# EAGLE design board2 (EAGLE 7.7.0)
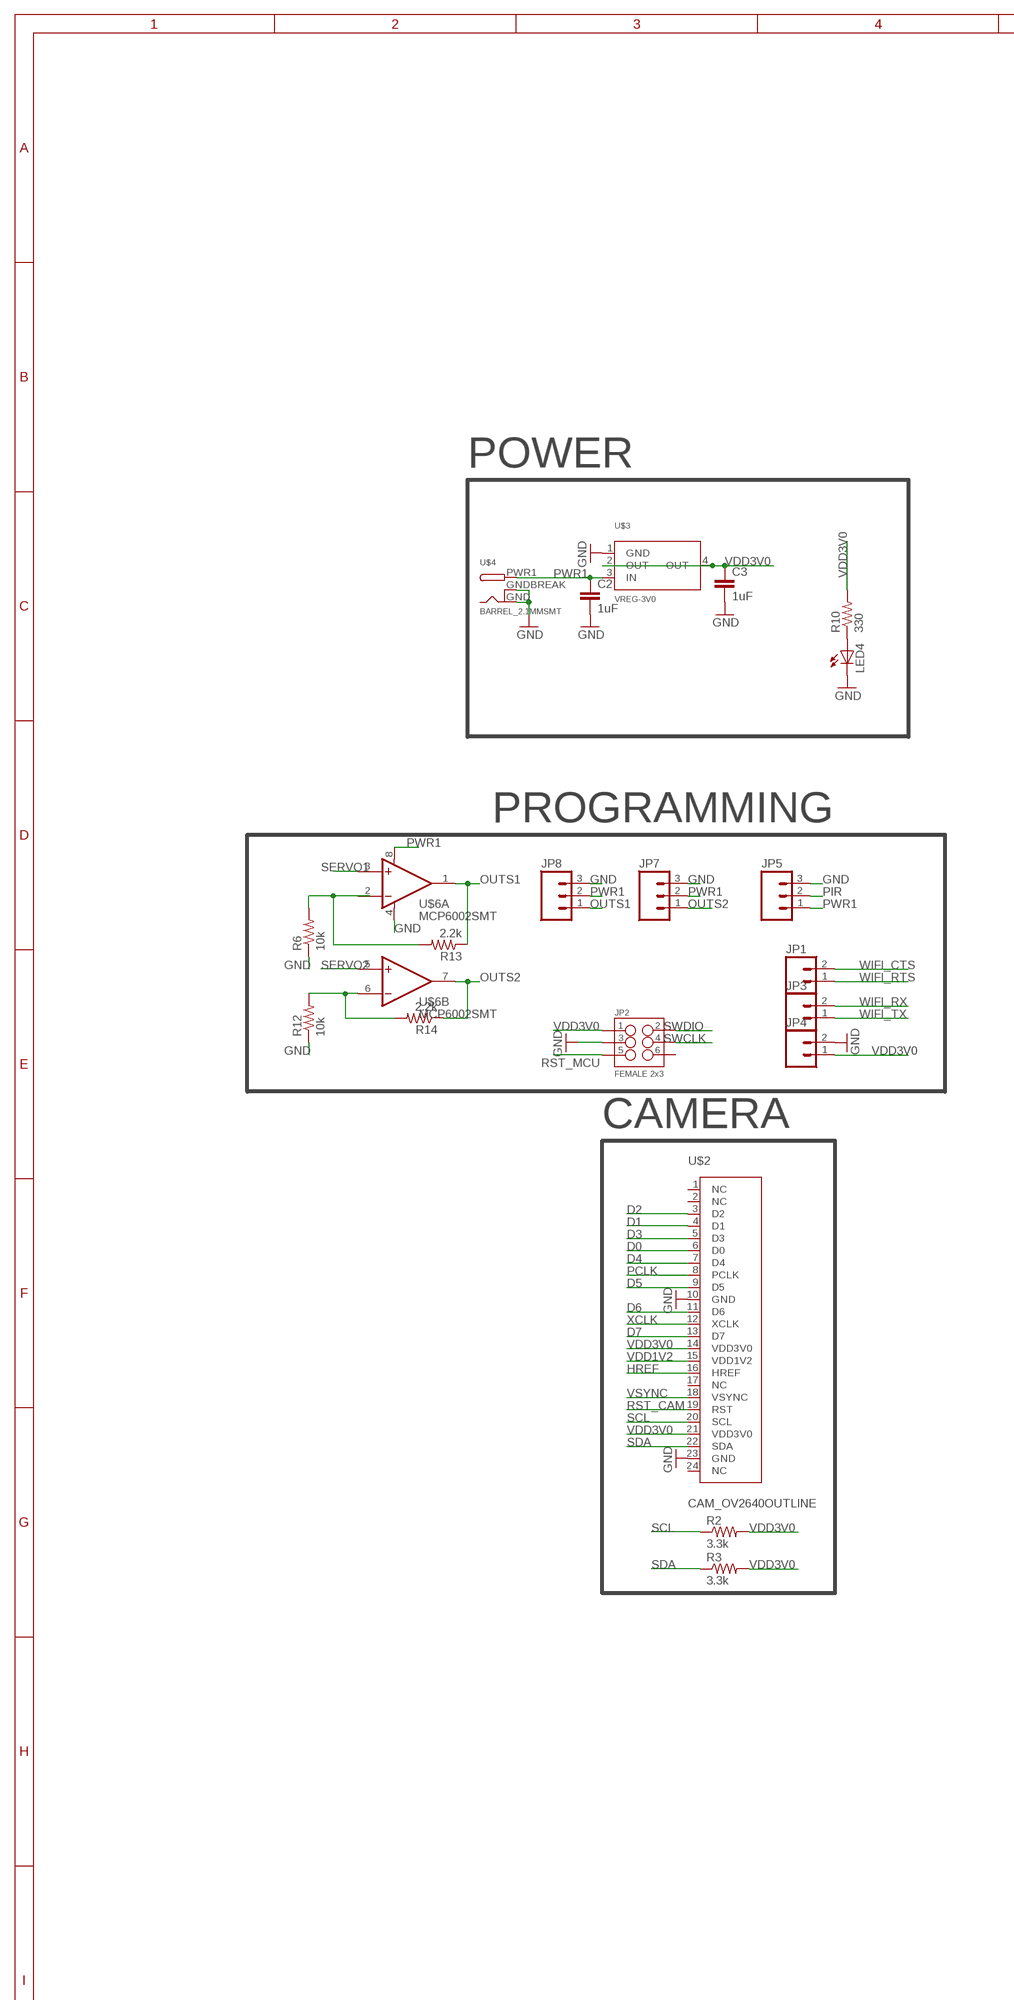
[diagram p0: schematic, sheet 1, part 1 of 2]
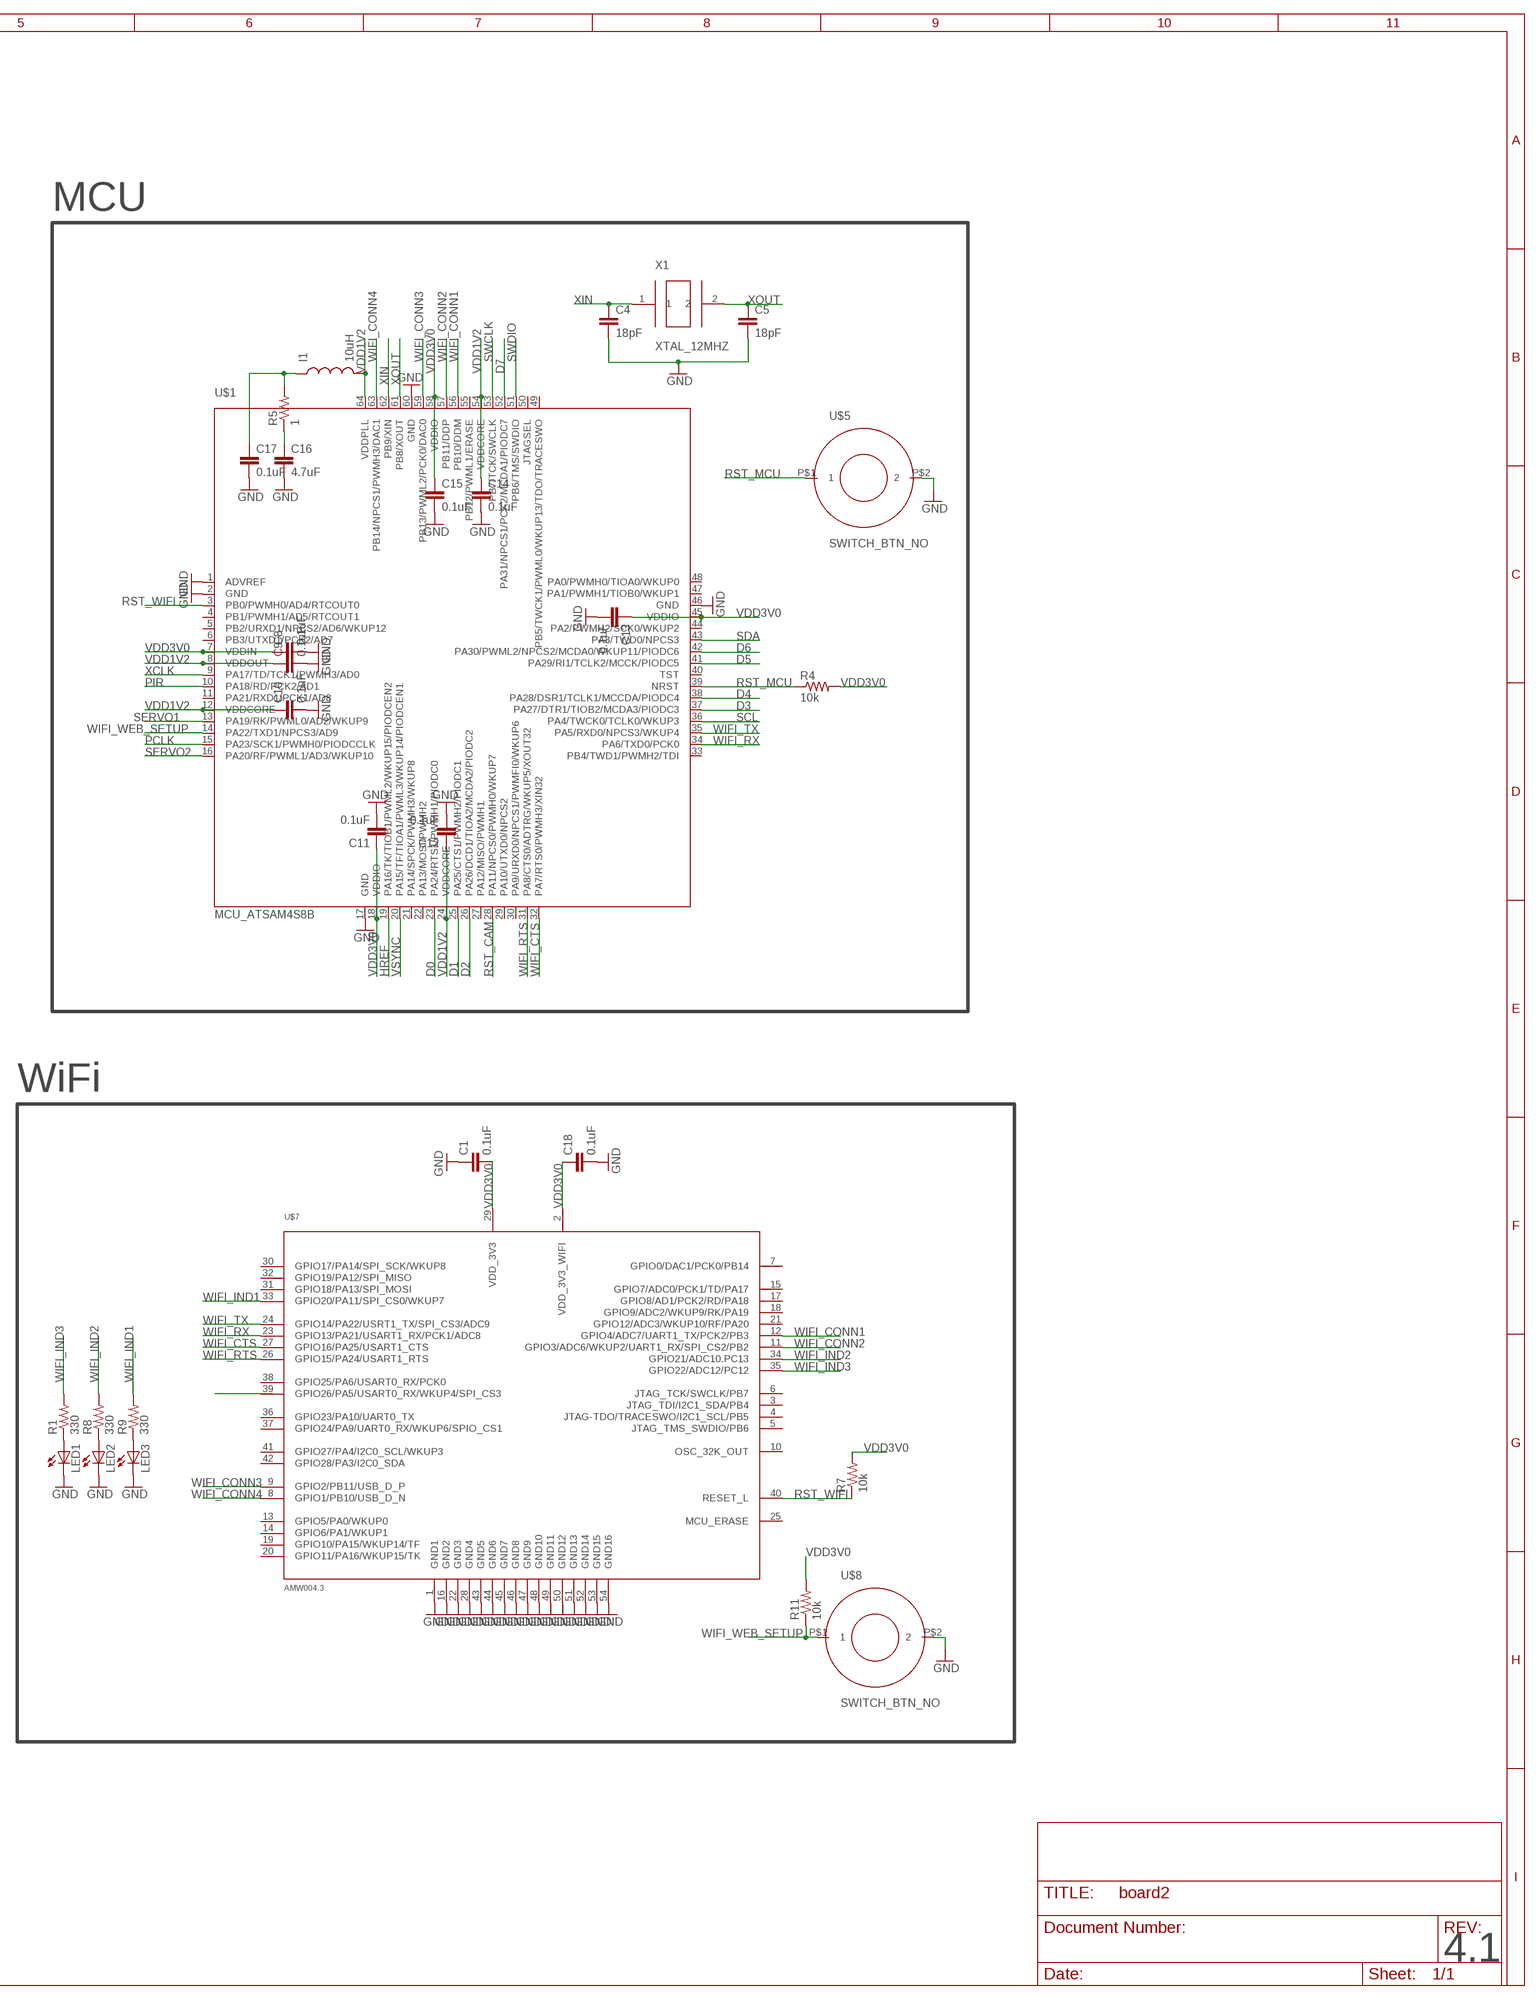
[diagram p1: schematic, sheet 1, part 2 of 2]

## Parts
C1  0.1uF  CAP  [0805]
C2  1uF  CAP  [0805]
C3  1uF  CAP  [0805]
C4  18pF  CAP  [0805]
C5  18pF  CAP  [0805]
C8  0.1uF  CAP  [0805]
C9  0.1uF  CAP  [0805]
C10  0.1uF  CAP  [0805]
C11  0.1uF  CAP  [0805]
C12  0.1uF  CAP  [0805]
C13  0.1uF  CAP  [0805]
C14  0.1uF  CAP  [0805]
C15  0.1uF  CAP  [0805]
C16  4.7uF  CAP  [0805]
C17  0.1uF  CAP  [0805]
C18  0.1uF  CAP  [0805]
I1  10uH  IND  [0805]
JP1  M02PTH  [1X02]
JP2  FEMALE 2x3  M03X2FEMALE  [2X3]
JP3  M02PTH  [1X02]
JP4  M02PTH  [1X02]
JP5  M03LOCK  [1X03_LOCK]
JP7  M03LOCK  [1X03_LOCK]
JP8  M03LOCK  [1X03_LOCK]
LED1  LED0603  [LED-0603]
LED2  LED0603  [LED-0603]
LED3  LED0603  [LED-0603]
LED4  LED0603  [LED-0603]
R1  330  RES  [0805]
R2  3.3k  RES  [0805]
R3  3.3k  RES  [0805]
R4  10k  RES  [0805]
R5  1  RES  [0805]
R6  10k  RES  [0805]
R7  10k  RES  [0805]
R8  330  RES  [0805]
R9  330  RES  [0805]
R10  330  RES  [0805]
R11  10k  RES  [0805]
R12  10k  RES  [0805]
R13  2.2k  RES  [0805]
R14  2.2k  RES  [0805]
U$1  MCU_ATSAM4S8B  [QFP50P1200X1200X160-64N]
U$2  CAM_OV2640OUTLINE  [CAM_CONN]
U$3  VREG-3V0  [R-PDSO-G4_TI]
U$4  BARREL_2.1MMSMT  [DCJACK_2MM_SMT]
U$5  SWITCH_BTN_NO  [BTN_2]
U$6  MCP6002SMT  [SOIC8]
U$7  AMW004.3  [AMW004]
U$8  SWITCH_BTN_NO  [BTN_2]
X1  XTAL_12MHZ  [ABM7-16.000MHZ-D2Y-T]

## Nets
D0: U$1.23(PA24/RTS1/PWMH1/PIODC0) U$2.6(D0)
D1: U$1.25(PA25/CTS1/PWMH2/PIODC1) U$2.4(D1)
D2: U$1.26(PA26/DCD1/TIOA2/MCDA2/PIODC2) U$2.3(D2)
D3: U$1.37(PA27/DTR1/TIOB2/MCDA3/PIODC3) U$2.5(D3)
D4: U$1.38(PA28/DSR1/TCLK1/MCCDA/PIODC4) U$2.7(D4)
D5: U$1.41(PA29/RI1/TCLK2/MCCK/PIODC5) U$2.9(D5)
D6: U$1.42(PA30/PWML2/NPCS2/MCDA0/WKUP11/PIODC6) U$2.11(D6)
D7: U$1.52(PA31/NPCS1/PCK2/MCDA1/PIODC7) U$2.13(D7)
GND: C1.1 C2.2 C3.2 C4.2 C5.2 C8.2 C9.2 C10.2 C11.2 C12.2 C13.2 C14.2 C15.2 C16.2 C17.2 C18.2 JP2.3 JP4.2 JP5.3 JP7.3 JP8.3 LED1.C LED2.C LED3.C LED4.C R6.1 R12.1 U$1.1(ADVREF) U$1.2(GND) U$1.17(GND) U$1.46(GND) U$1.60(GND) U$2.10(GND) U$2.23(GND) U$3.1(GND) U$4.GND U$4.GNDBREAK U$5.P$2 U$6.4(A:V-) U$7.1(GND1) U$7.16(GND2) U$7.22(GND3) U$7.28(GND4) U$7.43(GND5) U$7.44(GND6) U$7.45(GND7) U$7.46(GND8) U$7.47(GND9) U$7.48(GND10) U$7.49(GND11) U$7.50(GND12) U$7.51(GND13) U$7.52(GND14) U$7.53(GND15) U$7.54(GND16) U$8.P$2
HREF: U$1.19(PA16/TK/TIOB1/PWML2/WKUP15/PIODCEN2) U$2.16(HREF)
N$2: C17.1 I1.1 R5.2
N$3: C16.1 R5.1
N$4: LED1.A R1.1
N$5: LED2.A R8.1
N$6: LED3.A R9.1
N$7: LED4.A R10.1
N$8: R6.2 R13.2
N$14: R12.2 R14.2 U$6.6(B:-IN)
OUTS1: JP8.1 R13.1 U$6.1(A:OUT)
OUTS2: JP7.1 R14.1 U$6.7(B:OUT)
PCLK: U$1.15(PA23/SCK1/PWMH0/PIODCCLK) U$2.8(PCLK)
PIR: JP5.2 U$1.10(PA18/RD/PCK2/AD1)
PWR1: C2.1 JP5.1 JP7.2 JP8.2 U$3.3(IN) U$4.PWR1(PWR) U$6.8(A:V+)
RST_CAM: U$1.28(PA11/NPCS0/PWMH0/WKUP7) U$2.19(RST)
RST_MCU: JP2.5 R4.1 U$1.39(NRST) U$5.P$1
RST_WIFI: R7.1 U$1.3(PB0/PWMH0/AD4/RTCOUT0) U$7.40(RESET_L)
SCL: R2.1 U$1.36(PA4/TWCK0/TCLK0/WKUP3) U$2.20(SCL)
SDA: R3.1 U$1.43(PA3/TWD0/NPCS3) U$2.22(SDA)
SERVO1: U$1.13(PA19/RK/PWML0/AD2/WKUP9) U$6.3(A:+IN)
SERVO2: U$1.16(PA20/RF/PWML1/AD3/WKUP10) U$6.5(B:+IN)
SWCLK: JP2.4 U$1.53(PB7/TCK/SWCLK)
SWDIO: JP2.2 U$1.51(PB6/TMS/SWDIO)
VDD1V2: C9.1 C10.1 C12.1 C14.1 I1.2 U$1.8(VDDOUT) U$1.12(VDDCORE) U$1.24(VDDCORE) U$1.54(VDDCORE) U$1.64(VDDPLL) U$2.15(VDD1V2)
VDD3V0: C1.2 C3.1 C8.1 C11.1 C13.1 C15.1 C18.1 JP2.1 JP4.1 R2.2 R3.2 R4.2 R7.2 R10.2 R11.2 U$1.7(VDDIN) U$1.18(VDDIO) U$1.45(VDDIO) U$1.58(VDDIO) U$2.14(VDD3V0) U$2.21(VDD3V0) U$3.2(OUT) U$3.4(OUT) U$7.2(VDD_3V3_WIFI) U$7.29(VDD_3V3)
VSYNC: U$1.20(PA15/TF/TIOA1/PWML3/WKUP14/PIODCEN1) U$2.18(VSYNC)
WIFI_CONN1: U$1.56(PB10/DDM) U$7.12(GPIO4/ADC7/UART1_TX/PCK2/PB3)
WIFI_CONN2: U$1.57(PB11/DDP) U$7.11(GPIO3/ADC6/WKUP2/UART1_RX/SPI_CS2/PB2)
WIFI_CONN3: U$1.59(PB13/PWML2/PCK0/DAC0) U$7.9(GPIO2/PB11/USB_D_P)
WIFI_CONN4: U$1.63(PB14/NPCS1/PWMH3/DAC1) U$7.8(GPIO1/PB10/USB_D_N)
WIFI_CTS: JP1.2 U$1.32(PA7/RTS0/PWMH3/XIN32) U$7.27(GPIO16/PA25/USART1_CTS)
WIFI_IND1: R9.2 U$7.33(GPIO20/PA11/SPI_CS0/WKUP7)
WIFI_IND2: R8.2 U$7.34(GPIO21/ADC10.PC13)
WIFI_IND3: R1.2 U$7.35(GPIO22/ADC12/PC12)
WIFI_RTS: JP1.1 U$1.31(PA8/CTS0/ADTRG/WKUP5/XOUT32) U$7.26(GPIO15/PA24/USART1_RTS)
WIFI_RX: JP3.2 U$1.34(PA6/TXD0/PCK0) U$7.23(GPIO13/PA21/USART1_RX/PCK1/ADC8)
WIFI_TX: JP3.1 U$1.35(PA5/RXD0/NPCS3/WKUP4) U$7.24(GPIO14/PA22/USRT1_TX/SPI_CS3/ADC9)
WIFI_WEB_SETUP: R11.1 U$1.14(PA22/TXD1/NPCS3/AD9) U$8.P$1
XCLK: U$1.9(PA17/TD/TCK1/PWMH3/AD0) U$2.12(XCLK)
XIN: C4.1 U$1.62(PB9/XIN) X1.1
XOUT: C5.1 U$1.61(PB8/XOUT) X1.2
Unconnected: JP2.6 U$1.4(PB1/PWMH1/AD5/RTCOUT1) U$1.5(PB2/URXD1/NPCS2/AD6/WKUP12) U$1.6(PB3/UTXD1/PCK2/AD7) U$1.11(PA21/RXD1/PCK1/AD8) U$1.21(PA14/SPCK/PWMH3/WKUP8) U$1.22(PA13/MOSI/PWMH2) U$1.27(PA12/MISO/PWMH1) U$1.29(PA10/UTXD0/NPCS2) U$1.30(PA9/URXD0/NPCS1/PWMFI0/WKUP6) U$1.33(PB4/TWD1/PWMH2/TDI) U$1.40(TST) U$1.44(PA2/PWMH2/SCK0/WKUP2) U$1.47(PA1/PWMH1/TIOB0/WKUP1) U$1.48(PA0/PWMH0/TIOA0/WKUP0) U$1.49(PB5/TWCK1/PWML0/WKUP13/TDO/TRACESWO) U$1.50(JTAGSEL) U$1.55(PB12/PWML1/ERASE) U$2.1(NC) U$2.2(NC) U$2.17(NC) U$2.24(NC) U$6.2(A:-IN) U$7.3(JTAG_TDI/I2C1_SDA/PB4) U$7.4(JTAG-TDO/TRACESWO/I2C1_SCL/PB5) U$7.5(JTAG_TMS_SWDIO/PB6) U$7.6(JTAG_TCK/SWCLK/PB7) U$7.7(GPIO0/DAC1/PCK0/PB14) U$7.10(OSC_32K_OUT) U$7.13(GPIO5/PA0/WKUP0) U$7.14(GPIO6/PA1/WKUP1) U$7.15(GPIO7/ADC0/PCK1/TD/PA17) U$7.17(GPIO8/AD1/PCK2/RD/PA18) U$7.18(GPIO9/ADC2/WKUP9/RK/PA19) U$7.19(GPIO10/PA15/WKUP14/TF) U$7.20(GPIO11/PA16/WKUP15/TK) U$7.21(GPIO12/ADC3/WKUP10/RF/PA20) U$7.25(MCU_ERASE) U$7.30(GPIO17/PA14/SPI_SCK/WKUP8) U$7.31(GPIO18/PA13/SPI_MOSI) U$7.32(GPIO19/PA12/SPI_MISO) U$7.36(GPIO23/PA10/UART0_TX) U$7.37(GPIO24/PA9/UART0_RX/WKUP6/SPIO_CS1) U$7.38(GPIO25/PA6/USART0_RX/PCK0) U$7.39(GPIO26/PA5/USART0_RX/WKUP4/SPI_CS3) U$7.41(GPIO27/PA4/I2C0_SCL/WKUP3) U$7.42(GPIO28/PA3/I2C0_SDA)

## Notes on the sheet
- MCU
- POWER
- PROGRAMMING
- CAMERA
- WiFi
- 4.1

## Library data of the parts
C1-C5 C8-C18 = Ilya_Teach:CAP
I1 = Ilya_Teach:IND
JP1 JP3 JP4 = SparkFun:M02: Header 2 Standard 2-pin 0.1" header. Use with straight break away headers (SKU : PRT-00116), right angle break away headers (PRT-00553), swiss pins (PRT-00743), machine pins (PRT-00117), and female headers (PRT-00115). Molex polarized connector foot print use with SKU : PRT-08233 with associated crimp pins and housings.
JP2 = SparkFun-Connectors:M03X2: 2x3 .1" header. Shrouded, with keying- CONN-10681 SMT- CONN-11415 Pogo pins- HW-11044; PROD_ID: CONN-11566
JP5 JP7 JP8 = SparkFun:M03: Header 3 Standard 3-pin 0.1" header. Use with straight break away headers (SKU : PRT-00116), right angle break away headers (PRT-00553), swiss pins (PRT-00743), machine pins (PRT-00117), and female headers (PRT-00115). Molex polarized connector foot print use with SKU : PRT-08232 with associated crimp pins and housings.
LED1-LED4 = SparkFun:LED: LEDs Standard schematic elements and footprints for 5mm, 3mm, 1206, and 0603 sized LEDs. 5mm - Spark Fun Electronics SKU : COM-00529 (and others)
R1-R14 = Ilya_Teach:RES
U$1 = Ilya_Teach:MCU_ATSAM4S8B
U$2 = Ilya_Teach:CAM_OV2640
U$3 = Ilya_Teach:VREG-3V0
U$4 = Ilya_Teach:BARREL_2.1MM
U$5 U$8 = Ilya_Teach:SWITCH_BTN_NO
U$6 = adam - ics:MCP6002: Dual General Op Amp 1.8V min supply 1MHz (6V/us)
U$7 = AMW004_Eagle_PCB_Library:AMW004.3
X1 = Ilya_Teach:XTAL_12MHZ

## Board
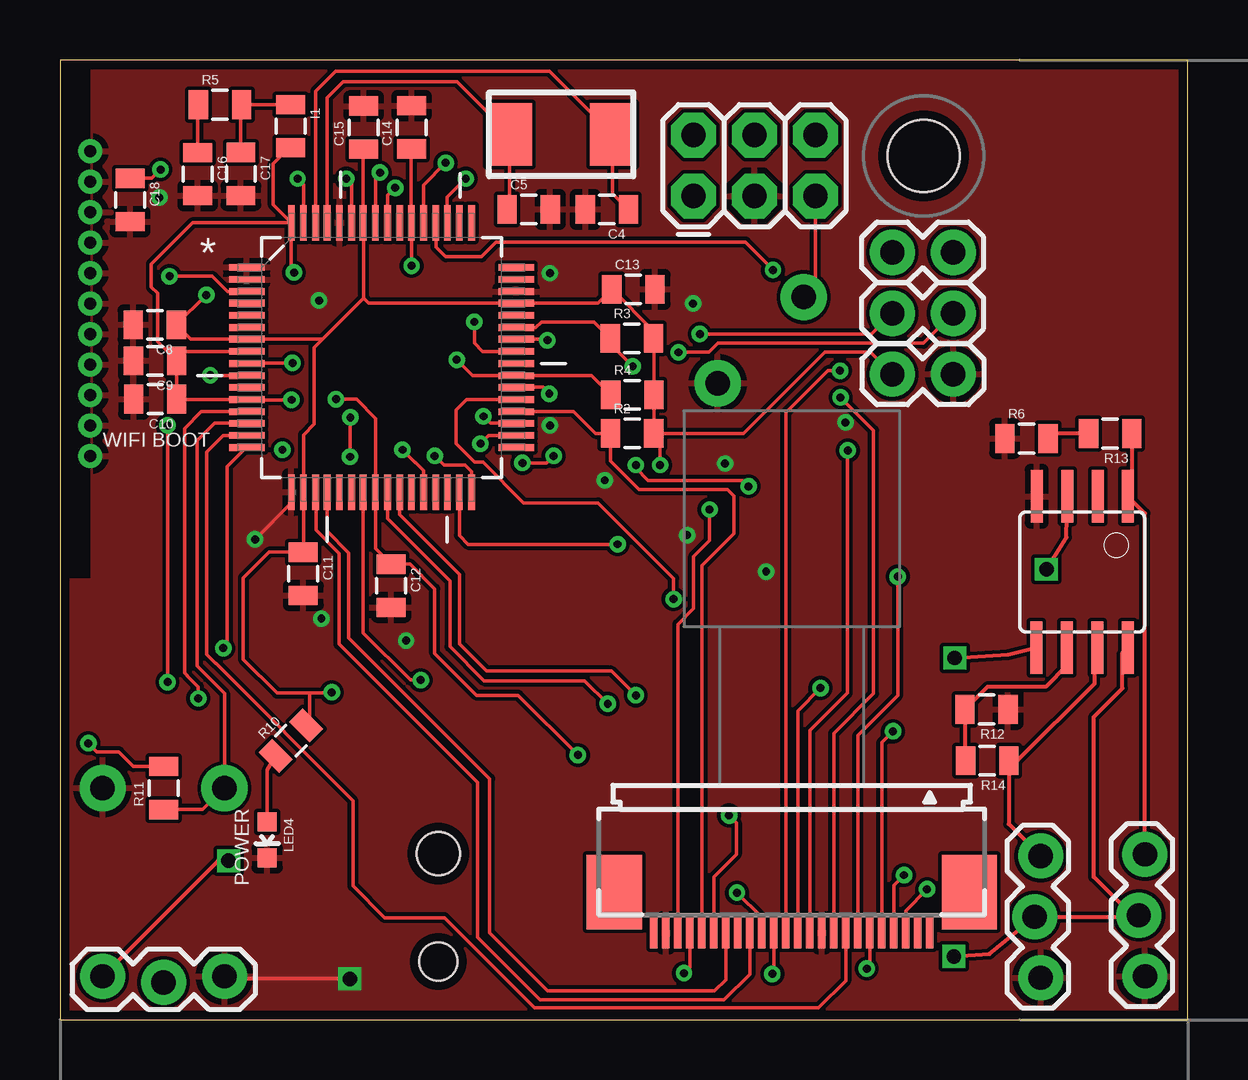
[diagram p2: board, top side]
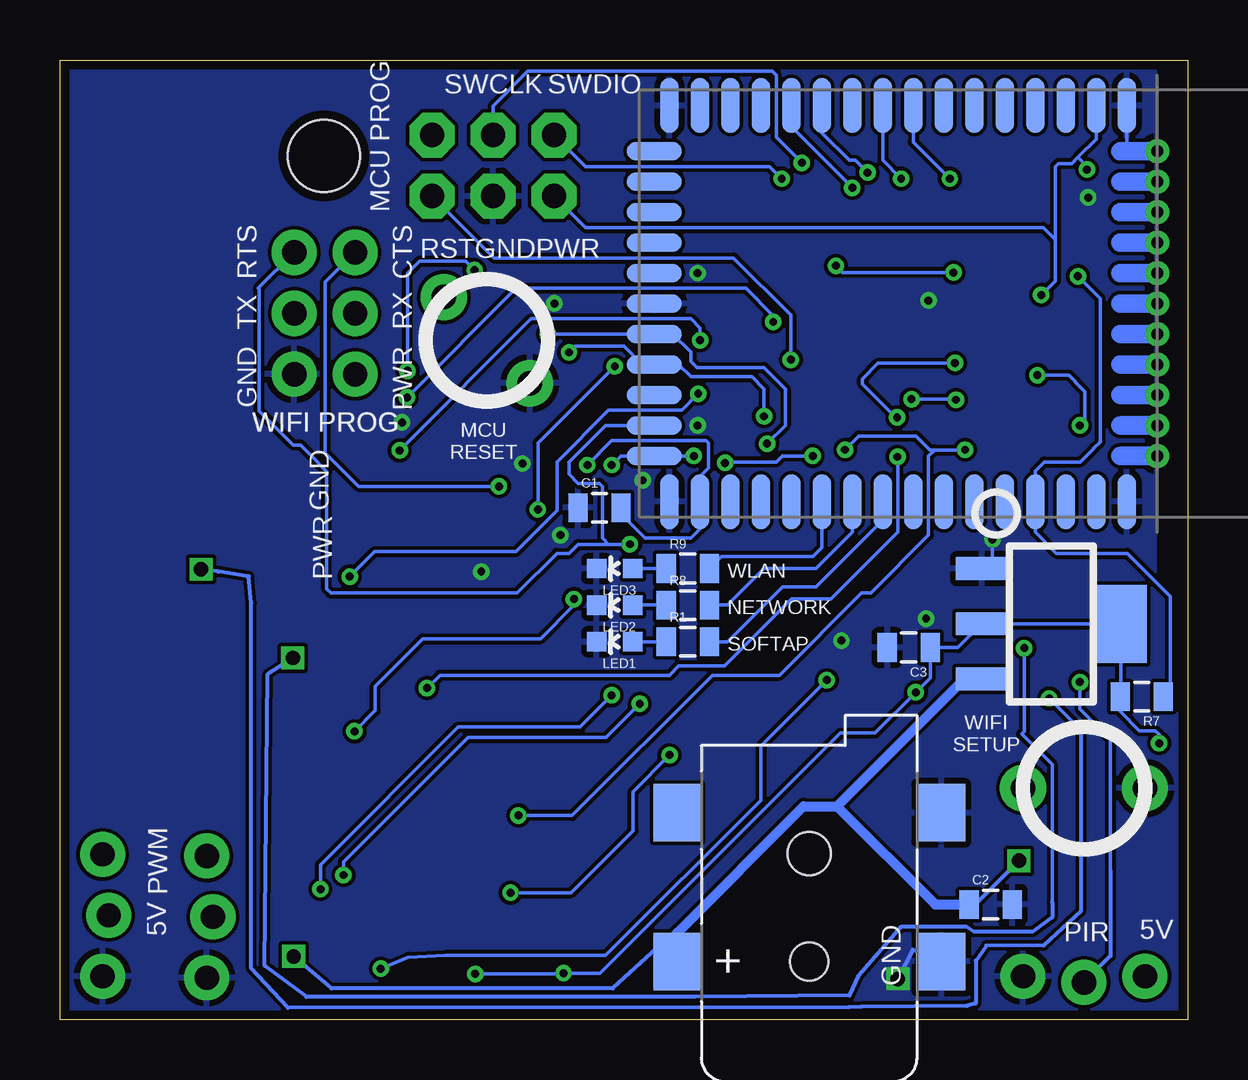
[diagram p3: board, bottom side, seen from below]

Size 47 x 40 mm. Coordinates in mm from the lower left corner, seen from the top.
Outline: 0,0 47,0 47,40 0,40 0,0
Copper layers (1*16): Top 0.0356mm / dielectric 1.5011mm / Bottom 0.0356mm
Design rules "LaenPCBOrder": minimum track width 6mil, minimum drill 13mil, track to track 6mil, track to pad 6mil, pad to pad 6mil, via to via 6mil, smd to smd 6mil, copper to edge 15mil, drill to drill 6mil, minimum pad ring 7mil, minimum via ring 7mil, stop-mask expansion 3mil, vias tented up to drill 0mil, thermal gap 10mil
Holes 3 mm at 36,36

### Footprints (pad centres in the part's own frame; a part is rotated, then mirrored left to right if it is on the bottom)
0805 = smd 0.8 x 1.2: 1 -0.9,0; 2 0.9,0
1X02 = drill 1.016 pad 1.88: 1 0,0; 2 2.54,0
2X3 = drill 1.016 pad 1.88 octagon: 1 0,0; 2 0,2.54; 3 2.54,0; 4 2.54,2.54; 5 5.08,0; 6 5.08,2.54
1X03_LOCK = drill 1.016 pad 1.88: 1 0,0.127; 2 2.54,-0.127; 3 5.08,0.127
LED-0603 = smd 0.8 x 0.8: A 0,-0.75; C 0,0.75
QFP50P1200X1200X160-64N = smd 1.473 x 0.279: 1 -5.613,3.759; 2 -5.613,3.251; 3 -5.613,2.743; 4 -5.613,2.261; 5 -5.613,1.753; 6 -5.613,1.245; 7 -5.613,0.762; 8 -5.613,0.254; 9 -5.613,-0.254; 10 -5.613,-0.762; 11 -5.613,-1.245; 12 -5.613,-1.753; 13 -5.613,-2.261; 14 -5.613,-2.743; 15 -5.613,-3.251; 16 -5.613,-3.759; 33 5.613,-3.759; 34 5.613,-3.251; 35 5.613,-2.743; 36 5.613,-2.261; 37 5.613,-1.753; 38 5.613,-1.245; 39 5.613,-0.762; 40 5.613,-0.254; 41 5.613,0.254; 42 5.613,0.762; 43 5.613,1.245; 44 5.613,1.753; 45 5.613,2.261; 46 5.613,2.743; 47 5.613,3.251; 48 5.613,3.759 | smd 0.279 x 1.473: 17 -3.759,-5.613; 18 -3.251,-5.613; 19 -2.743,-5.613; 20 -2.261,-5.613; 21 -1.753,-5.613; 22 -1.245,-5.613; 23 -0.762,-5.613; 24 -0.254,-5.613; 25 0.254,-5.613; 26 0.762,-5.613; 27 1.245,-5.613; 28 1.753,-5.613; 29 2.261,-5.613; 30 2.743,-5.613; 31 3.251,-5.613; 32 3.759,-5.613; 49 3.759,5.613; 50 3.251,5.613; 51 2.743,5.613; 52 2.261,5.613; 53 1.753,5.613; 54 1.245,5.613; 55 0.762,5.613; 56 0.254,5.613; 57 -0.254,5.613; 58 -0.762,5.613; 59 -1.245,5.613; 60 -1.753,5.613; 61 -2.261,5.613; 62 -2.743,5.613; 63 -3.251,5.613; 64 -3.759,5.613
CAM_CONN = smd 0.3 x 1.3: 1 -5.75,3.25; 2 -5.25,3.25; 3 -4.75,3.25; 4 -4.25,3.25; 5 -3.75,3.25; 6 -3.25,3.25; 7 -2.75,3.25; 8 -2.25,3.25; 9 -1.75,3.25; 10 -1.25,3.25; 11 -0.75,3.25; 12 -0.25,3.25; 13 0.25,3.25; 14 0.75,3.25; 15 1.25,3.25; 16 1.75,3.25; 17 2.25,3.25; 18 2.75,3.25; 19 3.25,3.25; 20 3.75,3.25; 21 4.25,3.25; 22 4.75,3.25; 23 5.25,3.25; 24 5.75,3.25 | smd 2.3 x 3.1: P1 -7.4,1.55; P2 7.4,1.55
R-PDSO-G4_TI = smd 0.95 x 2.15: 1 -2.3,-2.9; 2 0,-2.9; 3 2.3,-2.9 | smd 3.25 x 2.15: 4 0,2.9
DCJACK_2MM_SMT = smd 2.4 x 2: GND -2.54,-5.5; GNDBREAK 3.66,-5.5; PWR1 -2.54,5.5; PWR2 3.66,5.5 | hole 1.6: -2.54,0 | hole 1.8: 1.96,0
BTN_2 = drill 1.016 pad 1.93: P$1 -2.54,0; P$2 2.54,0
SOIC8 = smd 0.5 x 2.2: 1 -1.905,-3.154; 2 -0.645,-3.154; 3 0.625,-3.154; 4 1.895,-3.154; 5 1.905,3.154; 6 0.635,3.154; 7 -0.635,3.154; 8 -1.905,3.154
AMW004 = smd 0.762 x 2.286: 1 20.32,8.255; 2 19.05,8.255; 3 17.78,8.255; 4 16.51,8.255; 5 15.24,8.255; 6 13.97,8.255; 7 12.7,8.255; 8 11.43,8.255; 9 10.16,8.255; 10 8.89,8.255; 11 7.62,8.255; 12 6.35,8.255; 13 5.08,8.255; 14 3.81,8.255; 15 2.54,8.255; 16 1.27,8.255; 28 1.27,-8.255; 29 2.54,-8.255; 30 3.81,-8.255; 31 5.08,-8.255; 32 6.35,-8.255; 33 7.62,-8.255; 34 8.89,-8.255; 35 10.16,-8.255; 36 11.43,-8.255; 37 12.7,-8.255; 38 13.97,-8.255; 39 15.24,-8.255; 40 16.51,-8.255; 41 17.78,-8.255; 42 19.05,-8.255; 43 20.32,-8.255 | smd 2.286 x 0.762: 17 0.635,6.35; 18 0.635,5.08; 19 0.635,3.81; 20 0.635,2.54; 21 0.635,1.27; 22 0.635,0; 23 0.635,-1.27; 24 0.635,-2.54; 25 0.635,-3.81; 26 0.635,-5.08; 27 0.635,-6.35 | drill 0.5 pad 1: 44 21.59,-6.35; 45 21.59,-5.08; 46 21.59,-3.81; 47 21.59,-2.54; 48 21.59,-1.27; 49 21.59,0; 50 21.59,1.27; 51 21.59,2.54; 52 21.59,3.81; 53 21.59,5.08; 54 21.59,6.35
ABM7-16.000MHZ-D2Y-T = smd 1.9 x 2.6: 1 -2.15,0; 2 2.15,0

### Placement (x,y rotation side)
C1  24.51,21.34 0 bottom
C2  8.21,4.8 0 bottom
C3  11.62,15.51 180 bottom
C4  22.8,33.77 180 top
C5  19.54,33.77 0 top
C8  3.95,28.96 180 top
C9  3.96,27.46 180 top
C10  3.97,25.86 180 top
C11  10.14,18.58 270 top
C12  13.8,18.08 270 top
C13  23.9,30.44 0 top
C14  14.66,37.19 90 top
C15  12.66,37.18 90 top
C16  5.74,35.24 270 top
C17  7.54,35.25 270 top
C18  2.92,34.16 270 top
I1  9.61,37.24 270 top
JP1  37.24,31.98 180 top
JP2  26.41,34.33 0 top
JP3  37.24,29.44 180 top
JP4  34.7,26.9 0 top
JP5  1.78,1.68 0 top
JP7  40.75,6.82 270 top
JP8  45.1,6.88 270 top
LED1  23.88,15.75 90 bottom
LED2  23.88,17.27 90 bottom
LED3  23.88,18.8 90 bottom
LED4  8.64,7.49 180 top
R1  20.83,15.75 0 bottom
R2  23.85,24.43 0 top
R3  23.84,28.4 0 top
R4  23.86,26.04 0 top
R5  6.67,38.14 0 top
R6  40.28,24.22 0 top
R7  1.91,13.46 180 bottom
R8  20.83,17.27 0 bottom
R9  20.83,18.8 0 bottom
R10  9.63,11.62 45 top
R11  4.32,9.65 90 top
R12  38.62,12.93 180 top
R13  43.78,24.42 180 top
R14  38.65,10.79 180 top
U$1  13.4,27.6 0 top
U$2  30.5,6.87 180 top
U$3  5.68,16.5 270 bottom
U$4  15.77,4.96 90 bottom
U$5  29.21,28.32 315 bottom
U$6  42.61,18.66 180 top
U$7  22.86,29.84 0 bottom
U$8  4.32,9.65 0 bottom
X1  20.89,36.9 180 top

### Tracks (layer width: path | path; a pad name or v marks a point on that pad's centre or on a via)
D0  (via drill 0.33)
  Top 0.152: U$1.23 12.64,16.11 14.61,14.15 v15.04,14.15 | U$2.6 33.75,2.43 v33.63,2.12
  Bottom 0.152: v33.63,2.12 32.49,2.6 30.94,2.67 24.26,2.67 17.78,9.14 17.78,11.4 v15.04,14.15
D1  (via drill 0.33)
  Top 0.152: U$1.25 13.65,20.89 16.26,18.29 16.26,15.54 17.68,14.12 21.87,14.12 v22.84,13.16 | U$2.4 34.75,5.59 v35.18,6.02
  Bottom 0.152: v35.18,6.02 35.18,6.58 30,11.76 24.23,11.76 v22.84,13.16
D2  (via drill 0.33)
  Top 0.152: U$1.26 14.16,21.04 16.66,18.54 16.66,15.65 17.78,14.53 22.99,14.53 v24,13.51 | U$2.3 35.25,4.54 v36.14,5.44
  Bottom 0.152: v36.14,5.44 36.14,6.45 30.4,12.19 25.32,12.19 v24,13.51
D3  (via drill 0.33)
  Top 0.152: U$2.5 34.25,11.54 v34.72,12.01 | U$1.37 16.96,25.85 16.51,25.4 16.51,24 17.27,23.24 17.63,23.24 19.33,21.54 22.43,21.54 25.58,18.39 v25.58,17.53
  Bottom 0.152: v34.72,12.01 33.86,12.88 33.86,13.89 31.88,15.88 26.98,15.88 25.58,17.27 v25.58,17.53
D4  (via drill 0.33)
  Top 0.152: U$2.7 33.25,11.84 34.92,13.51 v34.92,18.47 | v20.4,26.09 20.13,26.36 U$1.38
  Bottom 0.152: v20.4,26.09 21.08,25.4 24.13,25.4 26.29,23.24 26.29,21.21 27.99,19.51 33.88,19.51 v34.92,18.47
D5  (via drill 0.33)
  Top 0.152: U$2.9 32.25,11.93 33.91,13.59 33.91,24.56 v32.54,25.93 | v17.27,29.08 17.27,28.19 17.61,27.85 U$1.41
  Bottom 0.152: v32.54,25.93 27.99,30.48 18.41,30.48 17.27,29.34 v17.27,29.08
D6  (via drill 0.33)
  Top 0.152: U$2.11 31.25,12.05 32.82,13.61 32.82,23.7 v32.84,23.72 | v20.32,28.32 20.28,28.36 U$1.42
  Bottom 0.152: v32.84,23.72 27.36,29.21 20.7,29.21 20.32,28.83 v20.32,28.32
D7  (via drill 0.33)
  Top 0.152: U$1.52 15.67,33.2 15.67,32.21 16.08,31.8 17.58,31.8 18.19,32.41 28.57,32.41 29.72,31.27 v29.72,31.24 | U$2.13 30.25,25.3 32,27.05 v32.51,27.05
  Bottom 0.152: v32.51,27.05 32.51,31.11 32,31.62 30.1,31.62 v29.72,31.24
GND  (via drill 0.33, 0.6)
  Top 0.152: U$1.17 9.64,21.53 v8.13,20.02
  Top 0.16: v12.08,1.69 6.97,1.69 JP5.3
  Bottom 0.152: U$7.1 2.54,36.2 U$7.54 | v8.13,20.02 8.13,19.25 U$3.1
  Bottom 0.16: U$4.GND 11.45,2.91 v12.08,1.69
  other vias: 14.43,15.8 10.9,16.71 20.42,31.11 10.79,29.97 4.14,34.26 26.39,29.84 29.44,18.67 22.71,22.48 20.42,24.77 26.14,20.19 32.74,24.89 27.72,23.18
  pour Top: 0,0 47.01,0.11 47.01,40.11 0,40
  pour Bottom: 0,0 47.1,0 47.1,39.89 0,40
HREF
  Top 0.152: U$2.16 28.75,1.88 27.69,0.81 20.02,0.81 17.4,3.43 17.4,9.88 11.63,15.65 11.63,19.43 10.67,20.4 10.67,21.98 U$1.19
N$2
  Top 0.152: I1.1 R5.2 7.54,38.11 C17.1
N$3
  Top 0.152: R5.1 5.74,38.11 C16.1
N$4
  Bottom 0.152: R1.1 LED1.A
N$5
  Bottom 0.152: R8.1 LED2.A
N$6
  Bottom 0.152: R9.1 LED3.A
N$7
  Top 0.152: LED4.A 8.64,10.41 R10.1
N$8
  Top 0.16: R13.2 41.39,24.42 R6.2
N$14
  Top 0.16: U$6.6 41.97,14.76 41.08,13.87 38.66,13.87 R12.2 37.72,10.82 R14.2
OUTS1
  Top 0.16: JP8.1 45.23,21.1 U$6.1 44.68,21.97 R13.1
OUTS2
  Top 0.16: JP7.1 39.55,8.15 R14.1 39.92,10.79 43.13,14.01 43.13,15.39 U$6.7
PCLK
  Top 0.152: U$1.15 6.8,24.35 6.11,23.66 6.11,15.21 6.49,14.83 6.5,14.83 12.22,9.12 12.22,5.56 13.54,4.24 16.03,4.24 19.79,0.48 31.62,0.48 32.75,1.61 U$2.8
PIR  (via drill 0.33)
  Top 0.152: U$1.10 6.28,26.84 v6.26,26.86 | v4.48,24.77 v4.48,14.07
  Bottom 0.152: v6.26,26.86 4.94,26.86 4.67,26.59 4.67,26.57 4.28,26.18 4.28,24.97 v4.48,24.77 | v4.48,14.07 4.48,12.95 3.21,11.68 3.21,6.18
  Bottom 0.16: 3.21,6.18 3.21,2.65 JP5.2
PWR1  (via drill 0.6)
  Top 0.16: v7.02,6.62 6.59,6.62 JP5.1 | v37.26,2.63 38.75,2.73 JP7.2 44.91,4.28 JP8.2 44.69,4.34 43.09,5.94 43.09,12.61 44.28,13.8 44.28,15.27 U$6.8
  Bottom 0.16: C2.1 8.84,4.8 v7.02,6.62 | 21.27,3.62 21.42,3.62 23.96,1.29 35.69,1.29 v37.26,2.63
  Bottom 0.406: 8.58,14.26 U$3.3 9.3,14.2 14.61,8.89 | U$4.PWR1 21.27,3.62 16,8.89 14.61,8.89 | 14.61,8.89 10.51,4.8 C2.1
RST_CAM  (via drill 0.33)
  Top 0.152: v27.89,8.51 28.19,8.2 28.19,6.88 27.25,5.94 U$2.19 | v9.27,23.75 9.18,23.84 | U$1.28 15.15,22.88 14.82,23.22 14.81,23.22 v14.28,23.75
  Bottom 0.152: v27.89,8.51 25.65,8.51 19.81,14.35 17.02,14.35 13.59,17.78 13.21,17.78 10.79,20.19 10.79,23.5 10.54,23.75 | 10.54,23.75 v9.27,23.75 | 10.54,23.75 10.74,23.75 11.33,24.33 13.7,24.33 14.28,23.76 v14.28,23.75
RST_MCU  (via drill 0.33)
  Top 0.152: R4.1 22.16,26.84 U$1.39 17.21,26.84 v16.54,27.51 16.46,27.51 | U$5.P$1 31.49,30.6 JP2.5
  Bottom 0.152: JP2.5 28.91,31.75 18.92,31.75 16.54,29.36 v16.54,27.51
RST_WIFI  (via drill 0.33)
  Top 0.152: v4.57,30.99 6.35,30.99 7,30.34 U$1.3
  Bottom 0.152: v4.57,30.99 3.65,30.06 3.65,24.08 3.9,23.82 3.9,23.81 4.47,23.24 5.97,23.24 6.35,22.86 U$7.40 6.35,20.32 5.46,19.43 2.52,19.43 0.72,17.64 0.72,13.74 R7.1
SCL
  Top 0.152: U$1.36 21.41,25.34 22.32,24.43 R2.1 22.95,23.28 24.13,22.1 27.81,22.1 28.09,21.82 28.09,20.27 26.75,18.93 U$2.20
SDA  (via drill 0.33)
  Top 0.152: v23.88,27.23 22.94,28.16 R3.1 22.26,29.08 20.07,29.08 19.83,28.84 U$1.43 | U$2.22 25.75,16.48 26.42,17.14 26.42,19.3 27.08,19.96 v27.08,21.26
  Bottom 0.152: v23.88,27.23 27.08,24.03 v27.08,21.26
SERVO1  (via drill 0.33, 0.6)
  Top 0.152: v5.77,13.39 5.77,13.87 5.31,14.33 5.31,14.34 5.19,14.45 5.19,24.64 5.89,25.34 U$1.13
  Top 0.16: v41.12,18.77 41.95,20.1 U$6.3
  Bottom 0.152: 4.46,12.08 v5.77,13.39
  Bottom 0.16: 4.46,12.08 4.46,4.51 5.99,3.09 8.39,3.07 8.83,2.45 8.83,0.67 9.2,0.57 13.58,0.53 14.1,0.52 37.49,0.48 39.03,2.13 39.03,17.36 39.13,18.48 40.39,18.67 v41.12,18.77
SERVO2  (via drill 0.33, 0.6)
  Top 0.152: U$1.16 7.76,23.84 6.97,23.05 6.97,15.65 v6.81,15.48
  Top 0.16: v37.3,15.07 39.53,15.21 U$6.5
  Bottom 0.152: v6.81,15.48 6.81,12 6.91,11.9 5.64,10.63 5.64,4.89
  Bottom 0.16: 5.64,4.89 5.64,4.25 6.45,3.66 8.9,3.66 9.22,3.87 11.94,3.86 13.73,1.82 14.08,1 20.51,0.95 36.73,0.94 38.47,2.23 38.34,14.4 v37.3,15.07
SWCLK  (via drill 0.33)
  Top 0.152: U$1.53 15.15,34.79 v16.08,35.71
  Bottom 0.152: JP2.4 28.95,38.08 27.51,39.52 17.3,39.52 17.14,39.37 17.14,36.78 v16.08,35.71
SWDIO  (via drill 0.33)
  Top 0.152: U$1.51 16.14,34.28 v16.92,35.05
  Bottom 0.152: v16.92,35.05 17.42,35.56 25.1,35.56 JP2.2
VDD1V2  (via drill 0.33)
  Top 0.152: C9.1 5.25,27.85 U$1.8 | C9.1 C10.1 4.88,25.85 U$1.12 7.8,25.83 v9.65,25.83 | C14.1 14.64,36.27 U$1.54 14.66,33.2 v14.66,31.42 | 9.64,36.31 I1.2 9.54,36.34 8.89,35.69 8.89,33.96 U$1.64 | U$1.64 5.53,33.21 3.81,31.5 3.81,30.53 4.06,30.28 4.06,28.26 C9.1 | U$2.15 29.25,4.25 v28.22,5.28 | v21.59,11.02 19.1,13.51 17.37,13.51 15.62,15.27 15.62,17.96 14.6,18.98 C12.1 13.15,19.64 U$1.24 13.15,24.22 13.16,24.23 13.16,25.06 12.36,25.86 v11.51,25.86 | U$1.64 9.64,31.25 v9.75,31.14
  Bottom 0.152: v11.51,25.86 9.68,25.86 v9.65,25.83 | v9.75,31.14 14.38,31.14 v14.66,31.42 | v28.22,5.28 25.7,5.28 23.11,7.87 23.11,9.5 v21.59,11.02
VDD3V0  (via drill 0.33)
  Top 0.152: C11.1 U$1.18 10.15,24.37 10.59,24.82 10.59,28.02 10.94,28.36 | C15.1 12.64,36.26 U$1.58 12.65,30.07 | R2.2 R4.2 24.76,28.38 R3.2 24.74,28.7 C13.1 22.42,29.86 U$1.45 12.86,29.86 12.65,30.07 | 10.94,28.36 U$1.7 5.45,28.36 C8.1 v6.09,30.2 v6.1,30.2 | 10.94,28.36 12.65,30.07 | C11.1 10.64,19.48 | C11.1 8.71,19.48 7.64,18.41 7.64,15.01 9.04,13.61 10.41,13.61 | 10.41,13.61 11.3,13.61 v11.33,13.64 | U$2.21 26.25,2.17 v26.01,1.93 | U$2.14 29.75,1.96 v29.69,1.91 | C18.1 3.82,35.06 v4.19,35.43 | JP4.1 33.78,27.81 31.88,27.81 28.5,24.43 R2.2 | R2.2 25.02,24.17 v25.02,23.11 | R10.2 10.41,12.45 10.41,13.61 | R11.2 3.06,10.55 2.45,11.16 1.54,11.16 v1.18,11.52
  Bottom 0.152: 10.69,15.48 C3.1 | C3.1 10.72,14.25 v11.33,13.64 13.03,11.94 14.48,11.94 24.49,1.93 v26.01,1.93 26.04,1.91 v29.69,1.91 | 5.51,32.51 5.51,35.56 5.38,35.69 4.83,35.69 4.57,35.94 | 5.51,32.51 5.51,30.79 v6.1,30.2 | JP2.1 25.1,33.02 6.02,33.02 5.51,32.51 | U$7.2 3.81,36.7 4.57,35.94 | v4.19,35.43 4.19,35.56 4.57,35.94 | C3.1 9.57,15.51 U$3.2 U$3.4 2.78,13.49 R7.2 2.81,12.84 2.01,12.04 1.33,12.04 1.18,11.89 v1.18,11.52 | v25.02,23.11 24,24.13 20.07,24.13 19.96,24.03 19.96,23 20.32,22.64 U$7.29 20.32,20.45 20.7,20.07 22.61,20.07 23.61,21.07 C1.2
VSYNC
  Top 0.152: U$2.18 27.75,1.66 27.28,1.19 20.32,1.19 17.91,3.61 17.91,10.03 12.04,15.9 12.04,19.46 11.12,20.37 11.12,21.97 U$1.20
WIFI_CONN1  (via drill 0.33)
  Top 0.152: v13.97,34.67 13.65,34.35 U$1.56
  Bottom 0.152: U$7.12 16.51,37.21 v13.97,34.67
WIFI_CONN2  (via drill 0.33)
  Top 0.152: U$1.57 13.15,35.12 v13.34,35.31
  Bottom 0.152: U$7.11 15.24,36.96 14.1,35.81 13.84,35.81 v13.34,35.31
WIFI_CONN3  (via drill 0.33)
  Top 0.152: v11.94,35.05 12.15,34.84 U$1.59
  Bottom 0.152: U$7.9 12.7,35.81 v11.94,35.05
WIFI_CONN4  (via drill 0.33)
  Top 0.152: v9.91,35.05 10.15,34.81 U$1.63
  Bottom 0.152: U$7.8 11.43,36.58 v9.91,35.05
WIFI_CTS  (via drill 0.33)
  Top 0.152: U$1.32 17.16,22.85 16.89,23.11 16,23.11 v15.62,23.5 | v28.7,22.23 28.45,22.48 24.51,22.48 24,22.99 v24,23.11 | v19.28,23.2 20.28,23.2 v20.57,23.5
  Bottom 0.152: JP1.2 35.94,30.73 35.94,23.62 34.54,22.23 v28.7,22.23 | v15.62,23.5 16.89,23.5 17.14,23.24 19.24,23.24 v19.28,23.2 | v24,23.11 23.62,23.5 U$7.27 v20.57,23.5
WIFI_IND1
  Bottom 0.152: U$7.33 15.24,19.68 15.62,19.3 19.42,19.3 R9.2
WIFI_IND2
  Bottom 0.152: U$7.34 13.97,20.32 15.49,18.8 17.65,18.8 19.18,17.27 R8.2
WIFI_IND3
  Bottom 0.152: U$7.35 12.7,20.83 15.49,18.03 16.89,18.03 19.18,15.75 R1.2
WIFI_RTS  (via drill 0.33)
  Top 0.152: U$1.31 16.65,20.18 17.02,19.81 v23.24,19.81
  Bottom 0.152: U$7.26 24.26,24.77 25.78,23.24 25.78,22.73 25.4,22.35 24.51,22.35 24.38,22.23 24.38,20.07 24.13,19.81 | JP1.1 38.73,30.48 38.7,30.44 38.7,25.38 37.27,23.95 36.97,23.95 36.23,23.22 36.23,23.19 35.88,22.84 35.88,17.96 35.7,17.78 27.94,17.78 26.29,19.43 25.78,19.43 25.4,19.81 24.13,19.81 | 24.13,19.81 v23.24,19.81
WIFI_RX  (via drill 0.33)
  Top 0.152: v17.53,24 17.87,24.35 U$1.34 | JP3.2 33.83,28.57 v26.67,28.57
  Bottom 0.152: v17.53,24 16.76,24.77 16.76,26.29 17.65,27.18 20.45,27.18 20.7,27.43 20.7,27.81 21.46,28.57 U$7.23 v26.67,28.57
WIFI_TX  (via drill 0.33)
  Top 0.152: v17.65,25.15 17.94,24.86 U$1.35 | v25.78,27.81 27.05,27.81 27.43,28.19 35.99,28.19 JP3.1
  Bottom 0.152: v17.65,25.15 17.65,26.29 18.16,26.8 20.7,26.8 21.21,27.3 U$7.24 22.73,27.3 23.5,28.07 25.53,28.07 v25.78,27.81
WIFI_WEB_SETUP
  Top 0.152: U$1.14 6.44,24.86 5.71,24.13 5.71,14.73 6.86,13.59 U$8.P$1 5.96,8.75 R11.1
XCLK  (via drill 0.33)
  Top 0.152: U$2.12 30.75,12.87 v31.7,13.82 | v12.09,23.46 12.09,25.08 v12.1,25.09 | v9.69,27.37 7.81,27.37 U$1.9
  Bottom 0.152: v31.7,13.82 31.17,14.35 21.59,14.35 21.21,14.73 19.3,14.73 16.51,17.53 14.86,17.53 12.06,20.32 12.06,23.43 v12.09,23.46 | v12.1,25.09 12.15,25.09 13.55,26.49 13.55,26.71 12.9,27.36 9.7,27.36 v9.69,27.37
XIN
  Top 0.152: U$1.62 10.66,38.7 11.48,39.52 20.41,39.52 X1.1 23.04,34.43 C4.1
XOUT
  Top 0.152: U$1.61 11.14,38.42 11.81,39.09 16.55,39.09 X1.2 18.74,33.87 C5.1

### Text on the board
tPlace: WIFI BOOT | POWER
bPlace: SWDIO | SWCLK | MCU PROG | CTS | RTS | PWR | GND | RST | RX | TX | PWR | GND | WIFI PROG | WIFI PROG | GND | MCU / RESET | PWR | WLAN | NETWORK | SOFTAP | WIFI / SETUP | PWM | 5V | 5V | PIR
tDocu: WEBCAM BOARD / VER 2.0 / 5/11/2017